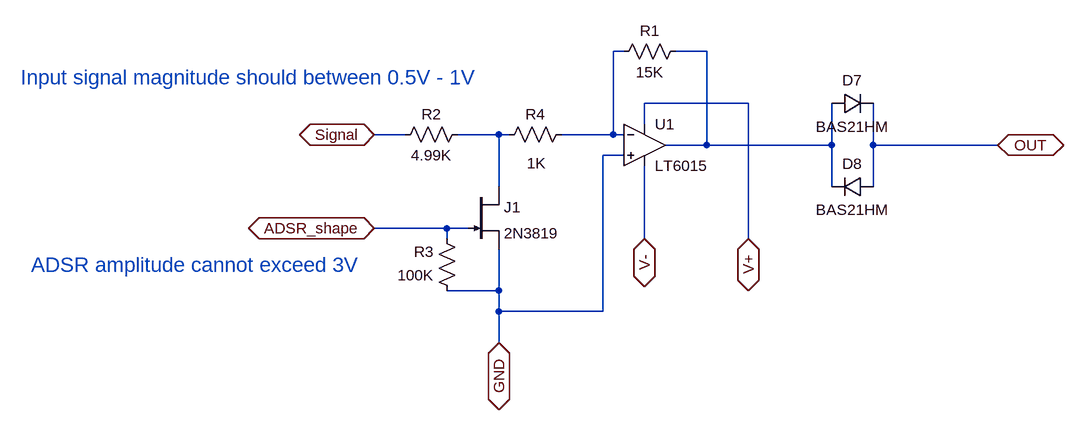
[diagram p0: schematic AM.asc]
AM.asc, the LTspice schematic file:
Version 4
SHEET 1 1244 680
WIRE 560 -48 544 -48
WIRE 688 -48 640 -48
WIRE 752 32 592 32
WIRE 592 64 592 32
WIRE 224 80 176 80
WIRE 368 80 304 80
WIRE 384 80 368 80
WIRE 544 80 544 -48
WIRE 544 80 464 80
WIRE 560 80 544 80
WIRE 688 96 688 -48
WIRE 688 96 624 96
WIRE 880 96 880 32
WIRE 880 96 688 96
WIRE 944 96 944 32
WIRE 1136 96 944 96
WIRE 560 112 528 112
WIRE 368 160 368 80
WIRE 880 160 880 96
WIRE 944 160 944 96
WIRE 288 224 176 224
WIRE 320 224 288 224
WIRE 288 240 288 224
WIRE 592 240 592 128
WIRE 752 240 752 32
WIRE 368 320 368 256
WIRE 368 320 288 320
WIRE 368 352 368 320
WIRE 528 352 528 112
WIRE 528 352 368 352
WIRE 368 400 368 352
FLAG 176 224 ADSR_shape
IOPIN 176 224 BiDir
FLAG 176 80 Signal
IOPIN 176 80 BiDir
FLAG 1136 96 OUT
IOPIN 1136 96 BiDir
FLAG 592 240 V-
IOPIN 592 240 BiDir
FLAG 752 240 V+
IOPIN 752 240 BiDir
FLAG 368 400 GND
IOPIN 368 400 BiDir
SYMBOL njf 320 160 R0
SYMATTR InstName J1
SYMATTR Value 2N3819
SYMBOL res 656 -64 R90
WINDOW 0 0 56 VBottom 2
WINDOW 3 32 56 VTop 2
SYMATTR InstName R1
SYMATTR Value 15K
SYMATTR SpiceLine tol=1 pwr=0.1
SYMBOL res 320 64 R90
WINDOW 0 0 56 VBottom 2
WINDOW 3 32 56 VTop 2
SYMATTR InstName R2
SYMATTR Value 4.99K
SYMATTR SpiceLine tol=1 pwr=0.1
SYMBOL res 304 336 R180
WINDOW 0 36 76 Left 2
WINDOW 3 36 40 Left 2
SYMATTR InstName R3
SYMATTR Value 100K
SYMATTR SpiceLine tol=1 pwr=0.1
SYMBOL res 368 96 R270
WINDOW 0 32 56 VTop 2
WINDOW 3 -12 58 VBottom 2
SYMATTR InstName R4
SYMATTR Value 1K
SYMATTR SpiceLine tol=1 pwr=0.1
SYMBOL diode 880 48 R270
WINDOW 0 36 32 VTop 2
WINDOW 3 -4 32 VBottom 2
SYMATTR InstName D7
SYMATTR Value BAS21HM
SYMBOL diode 944 176 M270
WINDOW 0 36 32 VTop 2
WINDOW 3 -4 32 VBottom 2
SYMATTR InstName D8
SYMATTR Value BAS21HM
SYMBOL Opamps\\LT6015 592 96 R0
SYMATTR InstName U1
TEXT -352 280 Left 3 ;ADSR amplitude cannot exceed 3V
TEXT -368 -8 Left 3 ;Input signal magnitude should between 0.5V - 1V

The netlist it stands for:
* AM.asc
J1 N003 ADSR_shape GND 2N3819
R1 N002 N001 15K tol=1 pwr=0.1
R2 N003 Signal 4.99K tol=1 pwr=0.1
R3 GND ADSR_shape 100K tol=1 pwr=0.1
R4 N003 N001 1K tol=1 pwr=0.1
D7 N002 OUT BAS21HM
D8 OUT N002 BAS21HM
XU1 GND N001 V+ V- N002 LT6016  ; LT6015, pins In+ In- V+ V- OUT
.model D D
.lib standard.dio
.model NJF NJF
.model PJF PJF
.lib standard.jft
* ADSR amplitude cannot exceed 3V
* Input signal magnitude should between 0.5V - 1V
.lib LTC2.lib
.backanno
.end